# Altium project PCB_Project1.PrjPCB
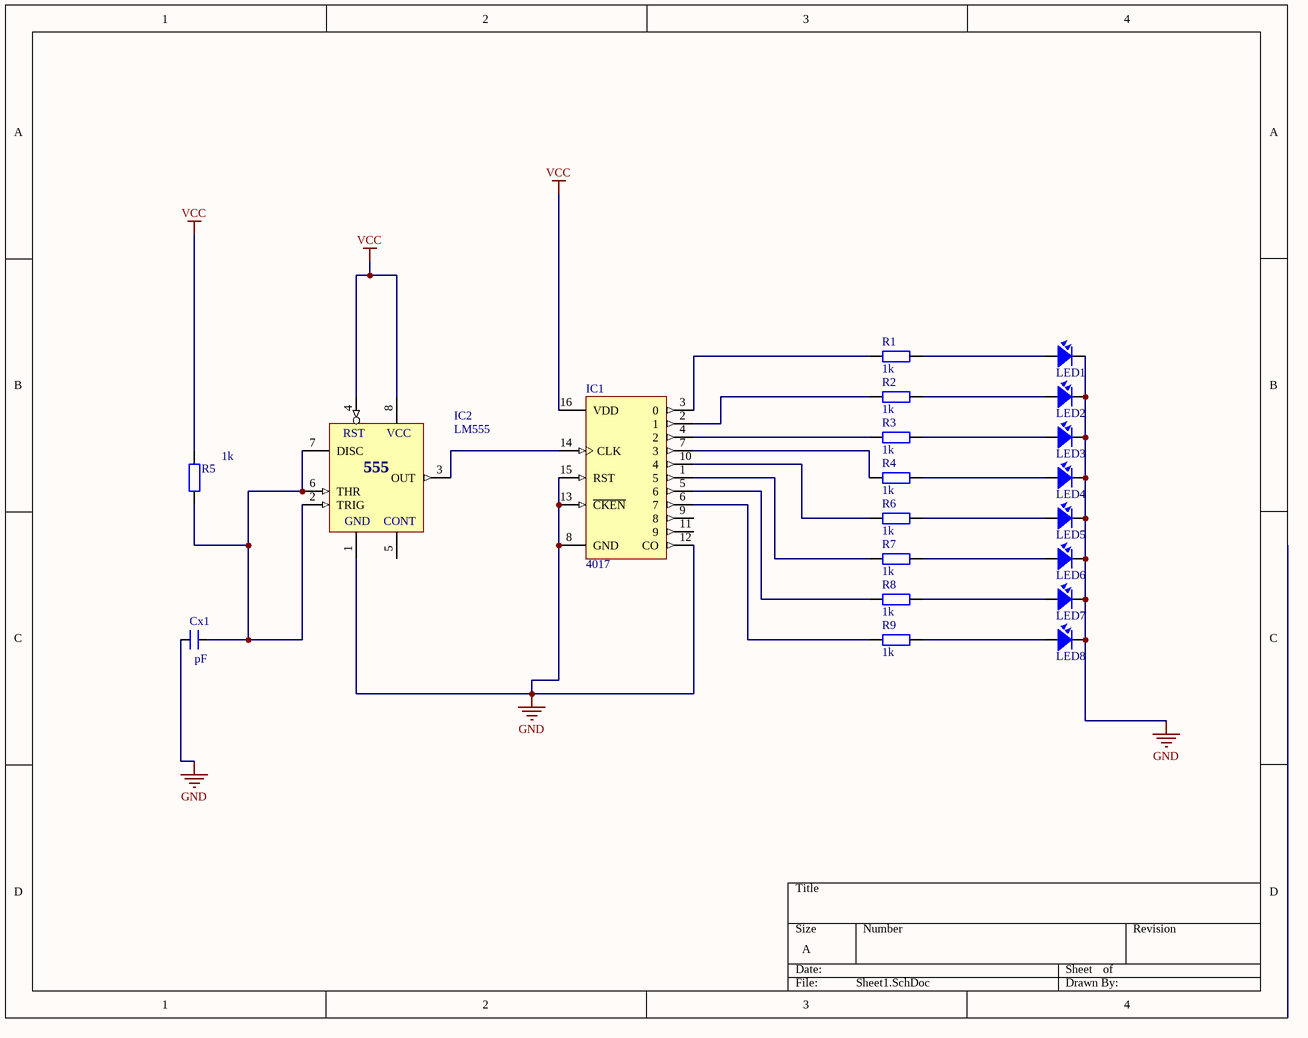
[diagram p0: Sheet1.SchDoc]
1 sheet, 20 parts. Net scope: global (net labels, ports and power ports of the same name join across sheets).
Board file: PCB1.PcbDoc

## Sheet Sheet1.SchDoc
size A

### Parts
Cx1  pF  [CN1]
IC1  4017  [DIP16/W0.3]
IC2  LM555  [DIP8/W0.3]
LED1  LED  [LED-3]  (value not drawn)
LED2  LED  [LED-3]  (value not drawn)
LED3  LED  [LED-3]  (value not drawn)
LED4  LED  [LED-3]  (value not drawn)
LED5  LED  [LED-3]  (value not drawn)
LED6  LED  [LED-3]  (value not drawn)
LED7  LED  [LED-3]  (value not drawn)
LED8  LED  [LED-3]  (value not drawn)
R1  1k  [R1/4W]
R2  1k  [R1/4W]
R3  1k  [R1/4W]
R4  1k  [R1/4W]
R5  1k  [R1/4W]
R6  1k  [R1/4W]
R7  1k  [R1/4W]
R8  1k  [R1/4W]
R9  1k  [R1/4W]

### Nets
GND: Cx1.1 IC1.8(GND) IC1.12(CO) IC1.13(~{CKEN}) IC1.15(RST) IC2.1(GND) LED1.2 LED2.2 LED3.2 LED4.2 LED5.2 LED6.2 LED7.2 LED8.2
VCC: IC1.16(VDD) IC2.4(RST) IC2.8(VCC) R5.1
NetCx1_2: Cx1.2 IC2.2(TRIG) IC2.6(THR) IC2.7(DISC) R5.2
NetIC1_1: IC1.1(5) R7.1
NetIC1_2: IC1.2(1) R2.1
NetIC1_3: IC1.3(0) R1.1
NetIC1_4: IC1.4(2) R3.1
NetIC1_5: IC1.5(6) R8.1
NetIC1_6: IC1.6(7) R9.1
NetIC1_7: IC1.7(3) R4.1
NetIC1_10: IC1.10(4) R6.1
NetIC1_14: IC1.14(CLK) IC2.3(OUT)
NetLED1_1: LED1.1 R1.2
NetLED2_1: LED2.1 R2.2
NetLED3_1: LED3.1 R3.2
NetLED4_1: LED4.1 R4.2
NetLED5_1: LED5.1 R6.2
NetLED6_1: LED6.1 R7.2
NetLED7_1: LED7.1 R8.2
NetLED8_1: LED8.1 R9.2

Not connected (* = marked no-connect by the designer): IC1 9(8) 11(9); IC2 5(CONT)

### Notes on the sheet
- (in symbol LM555) 555

### Library data of the parts
Cx1 = CN0: Cremic For Xtal 1pF => 100pF; Value: 33pF
IC1 = 4017: Decade Counter/Divider with 10 Decoded Outputs; Designed by: VanDungEvn; Value: CD4017
IC2 = LM555: Timer; Value: LM555
LED1-LED8 = LED: LED Single colour Green and Red; Value: LED 3 ly Single Colour
R1-R9 = R1/4W: Resistor 1/4W; Value: R1/4W - 1K